# EAGLE design SMALL_EAGLE7 (EAGLE 7.7.0)
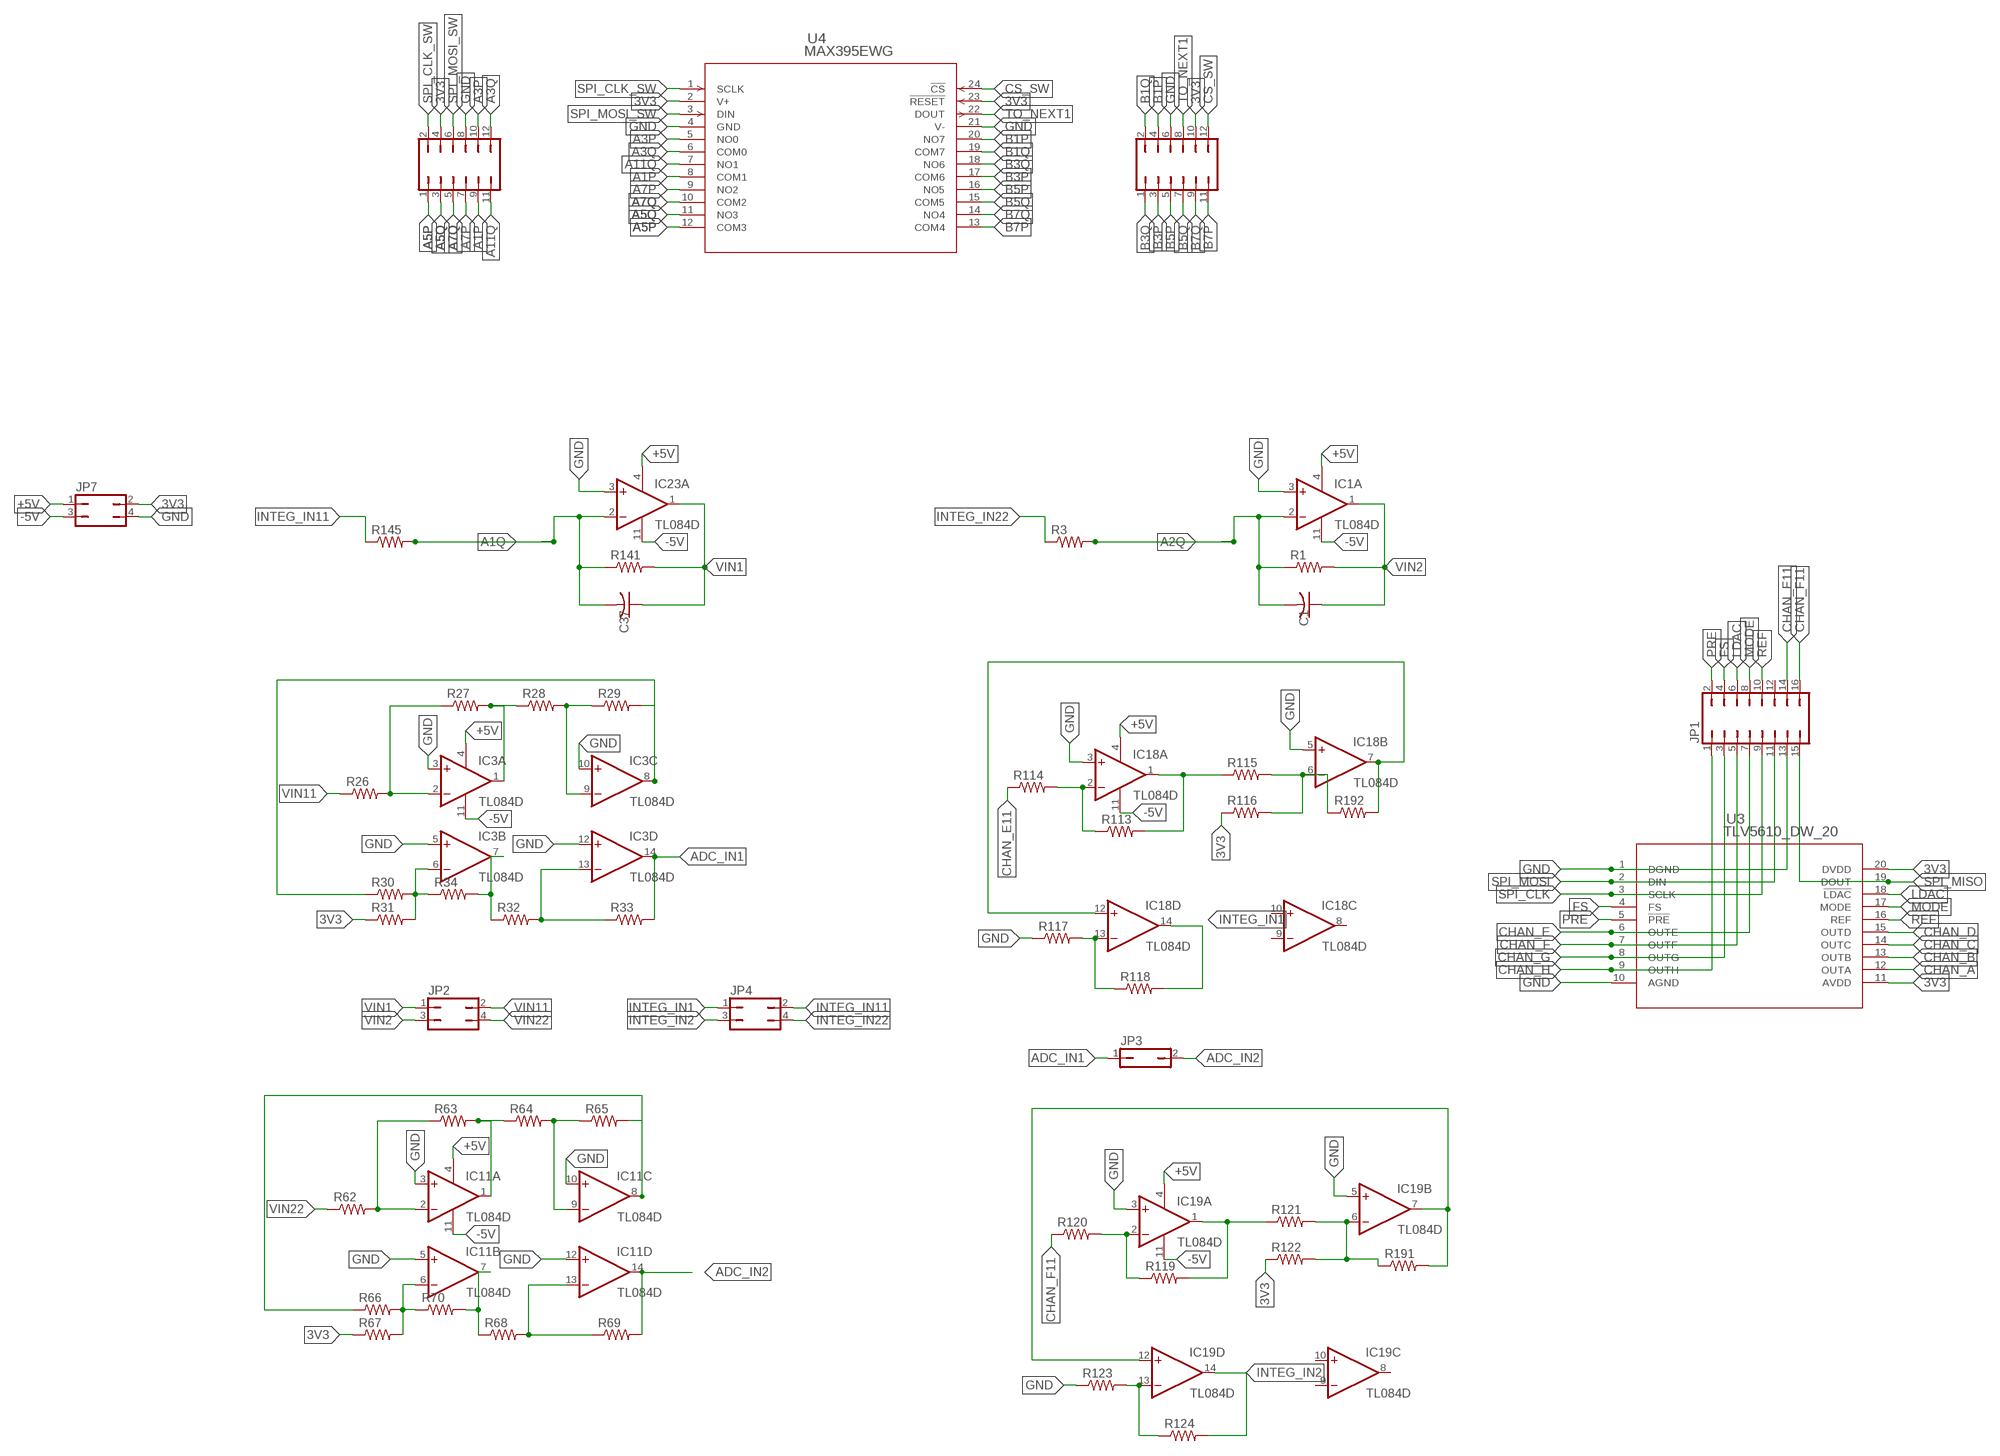
[diagram p0: schematic, sheet 1]

## Parts
C1  C-USC1206  [C1206]
C37  C-USC1206  [C1206]
IC1  TL084D  [SO14]
IC3  TL084D  [SO14]
IC11  TL084D  [SO14]
IC18  TL084D  [SO14]
IC19  TL084D  [SO14]
IC23  TL084D  [SO14]
JP1  JP8Q  [JP8Q]
JP2  JP2Q  [JP2Q]
JP3  JP1Q  [JP1]
JP4  JP2Q  [JP2Q]
JP5  JP6Q  [JP6Q]
JP6  JP6Q  [JP6Q]
JP7  JP2Q  [JP2Q]
R1  R-US_R1206  [R1206]
R3  R-US_R1206  [R1206]
R26  R-US_R1206  [R1206]
R27  R-US_R1206  [R1206]
R28  R-US_R1206  [R1206]
R29  R-US_R1206  [R1206]
R30  R-US_R1206  [R1206]
R31  R-US_R1206  [R1206]
R32  R-US_R1206  [R1206]
R33  R-US_R1206  [R1206]
R34  R-US_R1206  [R1206]
R62  R-US_R1206  [R1206]
R63  R-US_R1206  [R1206]
R64  R-US_R1206  [R1206]
R65  R-US_R1206  [R1206]
R66  R-US_R1206  [R1206]
R67  R-US_R1206  [R1206]
R68  R-US_R1206  [R1206]
R69  R-US_R1206  [R1206]
R70  R-US_R1206  [R1206]
R113  R-US_R1206  [R1206]
R114  R-US_R1206  [R1206]
R115  R-US_R1206  [R1206]
R116  R-US_R1206  [R1206]
R117  R-US_R1206  [R1206]
R118  R-US_R1206  [R1206]
R119  R-US_R1206  [R1206]
R120  R-US_R1206  [R1206]
R121  R-US_R1206  [R1206]
R122  R-US_R1206  [R1206]
R123  R-US_R1206  [R1206]
R124  R-US_R1206  [R1206]
R141  R-US_R1206  [R1206]
R145  R-US_R1206  [R1206]
R191  R-US_R1206  [R1206]
R192  R-US_R1206  [R1206]
U3  TLV5610_DW_20  [DW20]
U4  MAX395EWG  [21-0042B_24]

## Nets
3V3: JP5.4 JP6.10 JP7.2 R31.1 R67.1 R116.1 R122.1 U3.11(AVDD) U3.20(DVDD) U4.2(V+) U4.23(!RESET)
+5V: IC1.4(P:V+) IC3.4(P:V+) IC11.4(P:V+) IC18.4(P:V+) IC19.4(P:V+) IC23.4(P:V+) JP7.1
-5V: IC1.11(P:V-) IC3.11(P:V-) IC11.11(P:V-) IC18.11(P:V-) IC19.11(P:V-) IC23.11(P:V-) JP7.3
A1P: JP5.9 U4.8(COM1)
A1Q: C37.2 IC23.2(A:-IN) R141.1 R145.2
A2Q: C1.2 IC1.2(A:-IN) R1.1 R3.2
A3P: JP5.10 U4.5(NO0)
A3Q: JP5.12 U4.6(COM0)
A5P: JP5.1 U4.12(COM3)
A5Q: JP5.3 U4.11(NO3)
A7P: JP5.7 U4.9(NO2)
A7Q: JP5.5 U4.10(COM2)
A11Q: JP5.11 U4.7(NO1)
ADC_IN1: IC3.14(D:OUT) JP3.1 R33.2
ADC_IN2: IC11.14(D:OUT) JP3.2 R69.2
B1P: JP6.4 U4.20(NO7)
B1Q: JP6.2 U4.19(COM7)
B3P: JP6.3 U4.17(COM6)
B3Q: JP6.1 U4.18(NO6)
B5P: JP6.5 U4.16(NO5)
B5Q: JP6.7 U4.15(COM5)
B7P: JP6.11 U4.13(COM4)
B7Q: JP6.9 U4.14(NO4)
CHAN_A: U3.12(OUTA)
CHAN_B: U3.13(OUTB)
CHAN_C: U3.14(OUTC)
CHAN_D: U3.15(OUTD)
CHAN_E: JP1.7 U3.6(OUTE)
CHAN_E11: JP1.14 R114.1
CHAN_F: JP1.5 U3.7(OUTF)
CHAN_F11: JP1.16 R120.1
CHAN_G: JP1.3 U3.8(OUTG)
CHAN_H: JP1.1 U3.9(OUTH)
CS_SW: JP6.12 U4.24(!CS)
FS: JP1.4 U3.4(FS)
GND [power]: IC1.3(A:+IN) IC3.3(A:+IN) IC3.5(B:+IN) IC3.10(C:+IN) IC3.12(D:+IN) IC11.3(A:+IN) IC11.5(B:+IN) IC11.10(C:+IN) IC11.12(D:+IN) IC18.3(A:+IN) IC18.5(B:+IN) IC19.3(A:+IN) IC19.5(B:+IN) IC23.3(A:+IN) JP1.13 JP5.8 JP6.6 JP7.4 R117.1 R123.1 U3.1(DGND) U3.10(AGND) U4.4(GND) U4.21(V-)
INTEG_IN1: IC18.14(D:OUT) JP4.1 R118.2
INTEG_IN2: IC19.14(D:OUT) JP4.3 R124.2
INTEG_IN11: JP4.2 R145.1
INTEG_IN22: JP4.4 R3.1
LDAC: JP1.6 U3.18(!LDAC)
MODE: JP1.8 U3.17(MODE)
N$36: IC3.2(A:-IN) R26.2 R27.1
N$37: IC3.1(A:OUT) R27.2 R28.1
N$38: IC3.9(C:-IN) R28.2 R29.1
N$39: IC3.8(C:OUT) R29.2 R30.1
N$40: IC3.7(B:OUT) R32.1 R34.2
N$42: IC3.13(D:-IN) R32.2 R33.1
N$43: IC3.6(B:-IN) R30.2 R31.2 R34.1
N$68: IC11.2(A:-IN) R62.2 R63.1
N$69: IC11.1(A:OUT) R63.2 R64.1
N$70: IC11.9(C:-IN) R64.2 R65.1
N$71: IC11.8(C:OUT) R65.2 R66.1
N$72: IC11.7(B:OUT) R68.1 R70.2
N$74: IC11.13(D:-IN) R68.2 R69.1
N$75: IC11.6(B:-IN) R66.2 R67.2 R70.1
N$108: IC18.2(A:-IN) R113.1 R114.2
N$109: IC18.1(A:OUT) R113.2 R115.1
N$110: IC18.6(B:-IN) R115.2 R116.2 R192.1
N$111: IC18.13(D:-IN) R117.2 R118.1
N$113: IC18.7(B:OUT) IC18.12(D:+IN) R192.2
N$114: IC19.2(A:-IN) R119.1 R120.2
N$115: IC19.1(A:OUT) R119.2 R121.1
N$116: IC19.6(B:-IN) R121.2 R122.2 R191.1
N$117: IC19.13(D:-IN) R123.2 R124.1
N$119: IC19.7(B:OUT) IC19.12(D:+IN) R191.2
PRE: JP1.2 U3.5(!PRE)
REF: JP1.10 U3.16(REF)
SPI_CLK: JP1.9 U3.3(SCLK)
SPI_CLK_SW: JP5.2 U4.1(SCLK)
SPI_MISO: JP1.15 U3.19(DOUT)
SPI_MOSI: JP1.11 U3.2(DIN)
SPI_MOSI_SW: JP5.6 U4.3(DIN)
TO_NEXT1: JP6.8 U4.22(DOUT)
VIN1: C37.1 IC23.1(A:OUT) JP2.1 R141.2
VIN2: C1.1 IC1.1(A:OUT) JP2.3 R1.2
VIN11: JP2.2 R26.1
VIN22: JP2.4 R62.1
Unconnected: IC1.5(B:+IN) IC1.6(B:-IN) IC1.7(B:OUT) IC1.8(C:OUT) IC1.9(C:-IN) IC1.10(C:+IN) IC1.12(D:+IN) IC1.13(D:-IN) IC1.14(D:OUT) IC18.8(C:OUT) IC18.9(C:-IN) IC18.10(C:+IN) IC19.8(C:OUT) IC19.9(C:-IN) IC19.10(C:+IN) IC23.5(B:+IN) IC23.6(B:-IN) IC23.7(B:OUT) IC23.8(C:OUT) IC23.9(C:-IN) IC23.10(C:+IN) IC23.12(D:+IN) IC23.13(D:-IN) IC23.14(D:OUT) JP1.12

## Library data of the parts
C1 C37 = rcl:C-US: CAPACITOR, American symbol; SPICEPREFIX: C
IC1 IC3 IC11 IC18 IC19 IC23 = linear:TL084: OP AMP
JP1 = jumper:JP8Q: JUMPER
JP2 JP4 JP7 = jumper:JP2Q: JUMPER
JP3 = jumper:JP1Q: JUMPER
JP5 JP6 = jumper:JP6Q: JUMPER
R1 R3 R26-R34 R62-R70 R113-R124 R141 R145 R191 R192 = rcl:R-US_: RESISTOR, American symbol; SPICEPREFIX: R
U3 = tlv5610a:TLV5610_DW_20; MANUFACTURER_PART_NUMBER: TLV5610_DW_20; VENDOR: Texas Instruments
U4 = max395:MAX395EWG; MANUFACTURER_PART_NUMBER: max395ewg; VENDOR: Maxim Integrated Products

## Net classes
1 power: width 0.254 mm

## Board
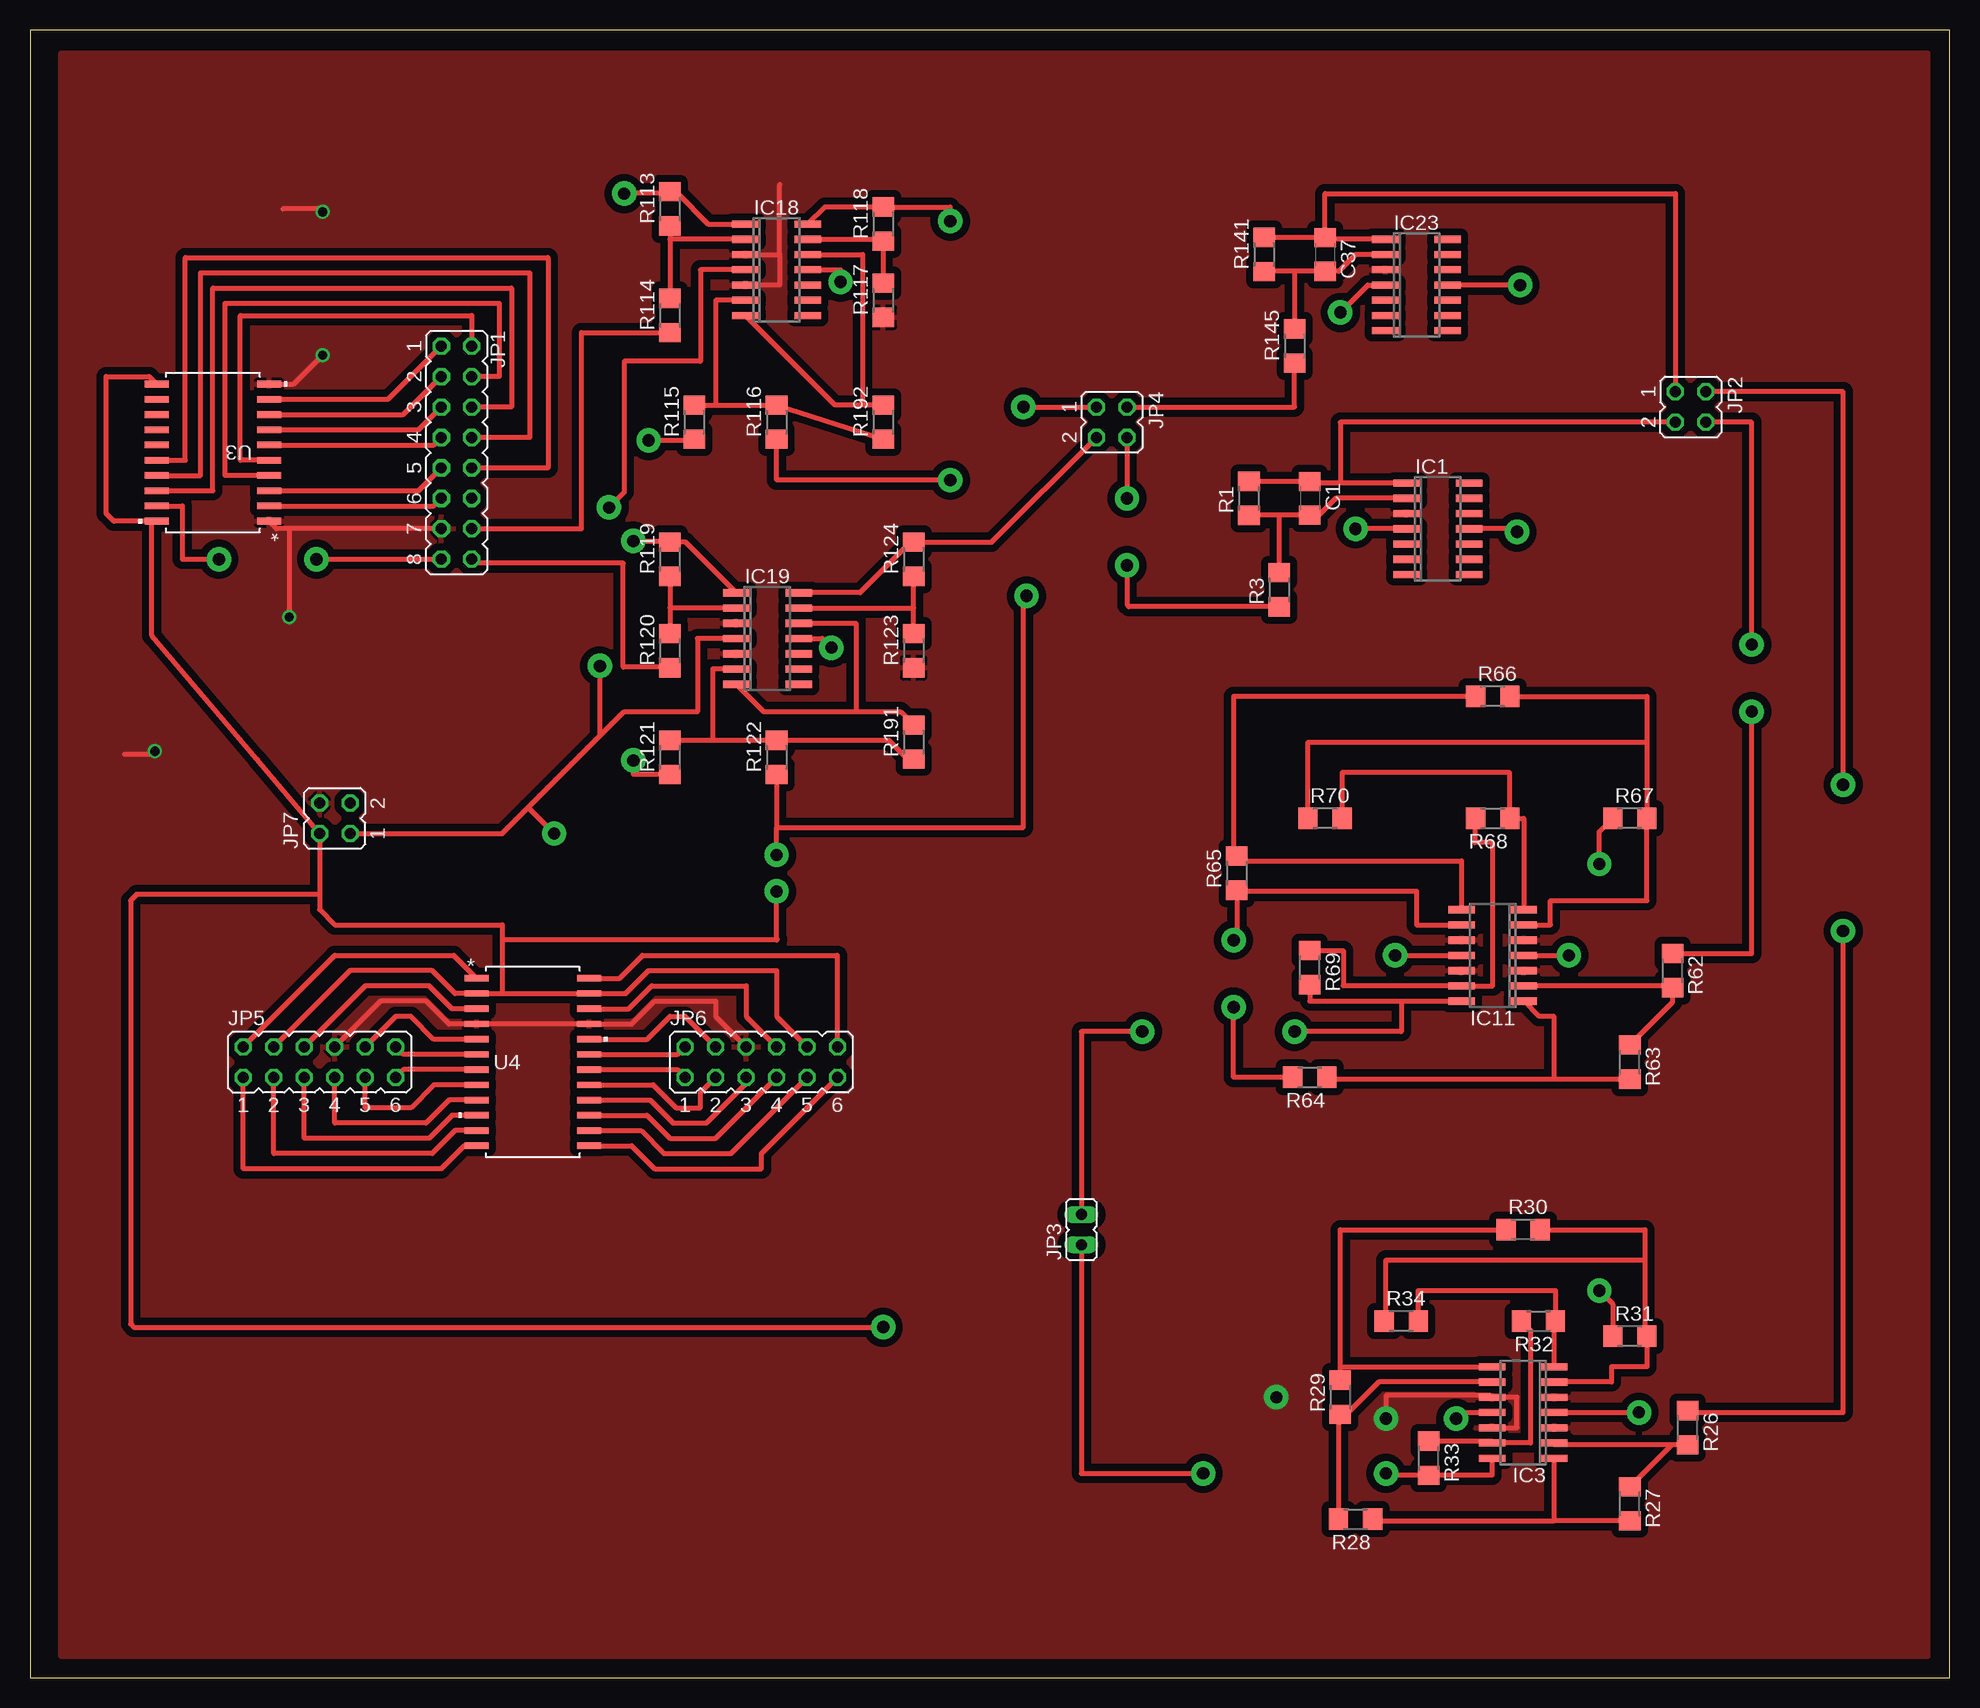
[diagram p1: board, top side]
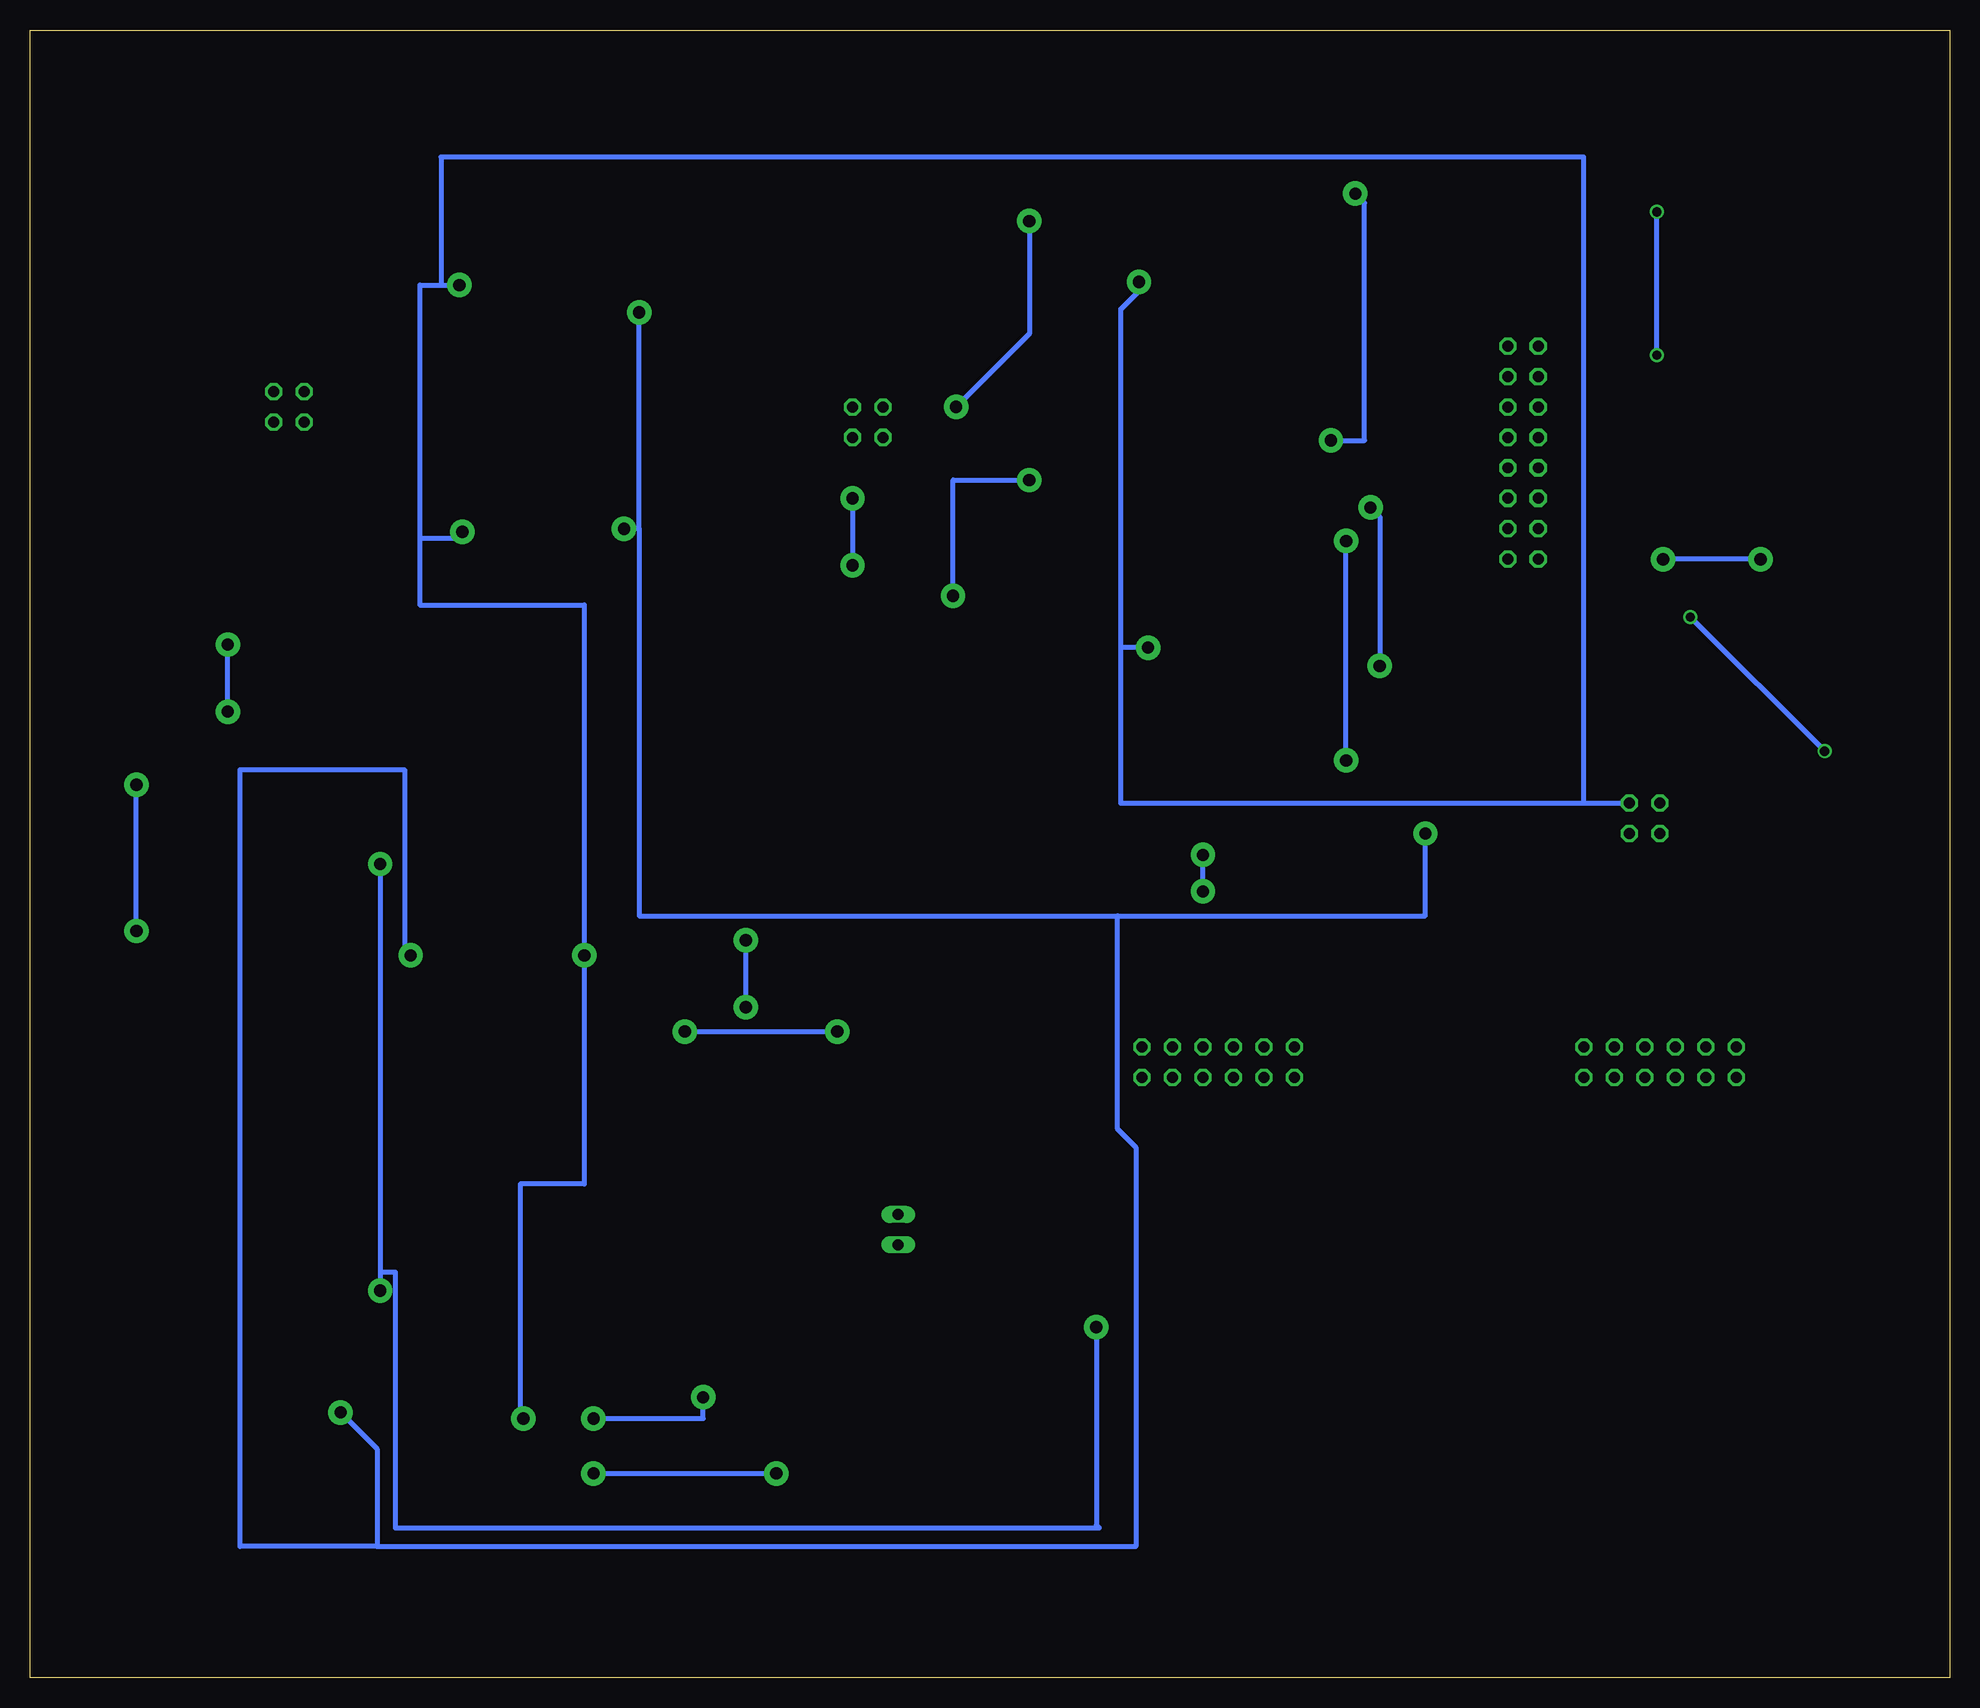
[diagram p2: board, bottom side, seen from below]

Size 160 x 137.34 mm. Coordinates in mm from the lower left corner, seen from the top.
Outline: 0,0 160,0 160,137.34 0,137.34 0,0
Copper layers (1*16): Top 0.035mm / dielectric 1.5mm / Bottom 0.035mm
Design rules "default *": minimum track width 16mil, minimum drill 30mil, track to track 24mil, track to pad 24mil, pad to pad 24mil, via to via 24mil, smd to smd 24mil, copper to edge 24mil, drill to drill 24mil, minimum pad ring 10mil, minimum via ring 8mil, stop-mask expansion 4mil, vias tented up to drill 0mil, thermal gap 10mil

### Footprints (pad centres in the part's own frame; a part is rotated, then mirrored left to right if it is on the bottom)
C1206 = smd 1.6 x 1.8: 1 -1.4,0; 2 1.4,0
SO14 = smd 0.6 x 2.2: 1 -3.81,-2.6; 2 -2.54,-2.6; 3 -1.27,-2.6; 4 0,-2.6; 5 1.27,-2.6; 6 2.54,-2.6; 7 3.81,-2.6; 8 3.81,2.6; 9 2.54,2.6; 10 1.27,2.6; 11 0,2.6; 12 -1.27,2.6; 13 -2.54,2.6; 14 -3.81,2.6
JP8Q = drill 0.914 octagon: 1 -8.89,-1.27; 2 -8.89,1.27; 3 -6.35,-1.27; 4 -6.35,1.27; 5 -3.81,-1.27; 6 -3.81,1.27; 7 -1.27,-1.27; 8 -1.27,1.27; 9 1.27,-1.27; 10 1.27,1.27; 11 3.81,-1.27; 12 3.81,1.27; 13 6.35,-1.27; 14 6.35,1.27; 15 8.89,-1.27; 16 8.89,1.27
JP2Q = drill 0.914 octagon: 1 -1.27,-1.27; 2 -1.27,1.27; 3 1.27,-1.27; 4 1.27,1.27
JP1 = drill 0.914 long: 1 0,-1.27; 2 0,1.27
JP6Q = drill 0.914 octagon: 1 -6.35,-1.27; 2 -6.35,1.27; 3 -3.81,-1.27; 4 -3.81,1.27; 5 -1.27,-1.27; 6 -1.27,1.27; 7 1.27,-1.27; 8 1.27,1.27; 9 3.81,-1.27; 10 3.81,1.27; 11 6.35,-1.27; 12 6.35,1.27
R1206 = smd 1.6 x 1.803: 1 -1.422,0; 2 1.422,0
DW20 = smd 1.981 x 0.559: 1 -4.686,5.715; 2 -4.686,4.445; 3 -4.686,3.175; 4 -4.686,1.905; 5 -4.686,0.635; 6 -4.686,-0.635; 7 -4.686,-1.905; 8 -4.686,-3.175; 9 -4.686,-4.445; 10 -4.686,-5.715; 11 4.686,-5.715; 12 4.686,-4.445; 13 4.686,-3.175; 14 4.686,-1.905; 15 4.686,-0.635; 16 4.686,0.635; 17 4.686,1.905; 18 4.686,3.175; 19 4.686,4.445; 20 4.686,5.715
21-0042B_24 = smd 1.981 x 0.533: 1 -4.686,6.985; 2 -4.686,5.715; 3 -4.686,4.445; 4 -4.686,3.175; 5 -4.686,1.905; 6 -4.686,0.635; 7 -4.686,-0.635; 8 -4.686,-1.905; 9 -4.686,-3.175; 10 -4.686,-4.445; 11 -4.686,-5.715; 12 -4.686,-6.985; 13 4.686,-6.985; 14 4.686,-5.715; 15 4.686,-4.445; 16 4.686,-3.175; 17 4.686,-1.905; 18 4.686,-0.635; 19 4.686,0.635; 20 4.686,1.905; 21 4.686,3.175; 22 4.686,4.445; 23 4.686,5.715; 24 4.686,6.985

### Placement (x,y rotation side)
C1  106.68,98.3 270 top
C37  107.95,118.62 270 top
IC1  117.35,95.76 270 top
IC3  124.46,22.1 90 top
IC11  121.92,60.2 90 top
IC18  62.23,117.35 270 top
IC19  61.47,86.61 270 top
IC23  115.57,116.08 270 top
JP1  35.56,102.11 270 top
JP2  138.43,105.92 270 top
JP3  87.63,37.34 0 top
JP4  90.17,104.65 270 top
JP5  24.13,51.31 0 top
JP6  60.96,51.31 0 top
JP7  25.4,71.63 90 top
R1  101.6,98.3 90 top
R3  104.14,90.68 90 top
R26  138.18,20.83 270 top
R27  133.35,14.48 270 top
R28  110.49,13.21 180 top
R29  109.22,23.37 90 top
R30  124.46,37.34 0 top
R31  133.35,28.45 0 top
R32  125.73,29.72 180 top
R33  116.59,18.29 270 top
R34  114.3,29.72 0 top
R62  136.91,58.93 270 top
R63  133.35,51.31 270 top
R64  106.68,50.04 180 top
R65  100.58,67.06 90 top
R66  121.92,81.79 0 top
R67  133.35,71.63 0 top
R68  121.92,71.63 180 top
R69  106.68,59.18 270 top
R70  107.95,71.63 0 top
R113  53.34,122.43 90 top
R114  53.34,113.54 90 top
R115  55.37,104.65 90 top
R116  62.23,104.65 90 top
R117  71.12,114.81 90 top
R118  71.12,121.16 90 top
R119  53.34,93.22 90 top
R120  53.34,85.6 90 top
R121  53.34,76.71 90 top
R122  62.23,76.71 90 top
R123  73.66,85.6 90 top
R124  73.66,93.22 90 top
R141  102.87,118.62 90 top
R145  105.41,111 90 top
R191  73.66,77.98 90 top
R192  71.12,104.65 90 top
U3  15.24,102.11 180 top
U4  41.91,51.31 0 top

### Tracks (layer width: path | path; a pad name or v marks a point on that pad's centre or on a via)
3V3  (via drill 1.02 pad 2.03)
  Top 0.406: JP5.4 26.67,58.93 33.53,58.93 35.43,57.02 U4.2 39.37,57.02 | JP6.10 62.23,55.12 62.23,58.93 51.56,58.93 49.66,57.02 U4.23 39.37,57.02 | 18.88,76.56 JP7.2 24.13,65.28 | 18.88,76.56 10.16,86.87 10.16,96.39 U3.20 6.99,96.39 6.35,97.03 6.35,108.46 9.92,108.46 U3.11 | 19.05,76.39 18.88,76.56 | 24.13,65.28 24.13,64.01 25.4,62.74 39.37,62.74 39.37,61.47 | 39.37,61.47 39.37,57.02 | R122.1 62.23,70.87 | 62.23,61.47 39.37,61.47 | v130.81,67.82 130.81,70.51 R67.1 | v130.81,32.26 131.93,31.14 R31.1 | 62.23,70.87 82.8,70.87 82.8,90.17 v83.06,90.17 | v76.71,99.82 62.23,99.82 R116.1 | 62.23,61.47 v62.23,65.53 | v62.23,68.58 62.23,70.87 | 62.31,61.54 62.23,61.47 | 24.13,65.28 8.89,65.28 8.38,64.77 8.38,29.46 8.64,29.21 v71.12,29.21
  Bottom 0.406: v130.81,67.82 130.81,33.78 | 130.81,33.78 v130.81,32.26 | v71.12,29.21 71.12,12.7 70.87,12.45 129.54,12.45 129.54,33.78 130.81,33.78 | v83.06,90.17 83.06,99.82 v76.71,99.82 | v62.23,65.53 v62.23,68.58
+5V  (via drill 1.02 pad 2.03)
  Top 0.406: IC19.4 55.63,86.61 55.63,80.52 49.53,80.52 47.5,78.49 | JP7.1 39.37,70.36 41.53,72.52 | 41.53,72.52 47.5,78.49 | IC18.4 55.88,117.35 55.88,109.73 49.53,109.73 49.53,98.81 v48.26,97.54 | v47.5,84.33 47.5,78.49 | IC11.4 v128.27,60.2 | v43.69,70.36 41.53,72.52 | IC3.4 v134.11,22.1 | IC1.4 v110.49,95.76 | v109.22,113.79 111.51,116.08 IC23.4
  Bottom 0.406: v48.26,97.54 47.5,96.77 v47.5,84.33 | 69.34,63.5 43.69,63.5 v43.69,70.36 | 69.34,63.5 69.34,45.72 67.82,44.2 67.82,10.92 131.06,10.92 | 109.22,95.76 v109.22,113.79 | 109.22,95.76 v110.49,95.76 | v134.11,22.1 131.06,19.05 131.06,10.92 | 131.06,10.92 142.49,10.92 142.49,75.69 128.78,75.69 128.78,60.71 v128.27,60.2 | 109.22,95.76 109.22,63.5 69.34,63.5
-5V  (via drill 1.02 pad 2.03)
  Top 0.406: IC18.11 67.56,117.35 v67.56,116.33 | IC19.11 66.04,86.61 v66.8,85.85 | v124.21,116.08 IC23.11 | v123.95,95.5 123.95,95.76 IC1.11 | v113.79,60.2 IC11.11 | v118.87,21.59 119.38,22.1 IC3.11
  Bottom 0.406: v67.56,116.33 67.56,115.57 69.09,114.05 69.09,85.85 | 69.09,85.85 69.09,72.9 30.48,72.9 | 30.48,72.9 JP7.3 | v66.8,85.85 69.09,85.85 | 30.48,72.9 30.48,126.75 125.73,126.75 125.73,116.08 | 127.51,95 127.51,116.08 125.73,116.08 | 127.51,95 127.51,89.41 113.79,89.41 v113.79,60.2 113.79,41.15 119.13,41.15 119.13,21.84 v118.87,21.59 | 125.73,116.08 v124.21,116.08 | 127.51,95 124.46,95 v123.95,95.5
A1P
  Top 0.406: U4.8 33.66,49.4 31.75,47.5 27.94,47.5 JP5.9
A1Q
  Top 0.406: 105.41,117.22 C37.2 109.09,117.22 110.49,118.62 IC23.2 | 105.41,117.22 102.89,117.22 R141.1 | 105.41,117.22 R145.2
A2Q
  Top 0.406: 104.14,96.9 C1.2 107.44,96.9 108.85,98.31 IC1.2 | 104.14,96.9 101.62,96.9 R1.1 | R3.2 104.14,96.9
A3P
  Top 0.406: U4.5 33.66,53.21 31.75,55.12 30.48,55.12 JP5.10
A3Q
  Top 0.406: U4.6 31.11,51.94 JP5.12
A5P
  Top 0.406: U4.12 36.2,44.32 34.29,42.42 17.78,42.42 JP5.1
A5Q
  Top 0.406: U4.11 35.43,45.59 33.53,43.69 20.32,43.69 JP5.3
A7P
  Top 0.406: U4.9 34.92,48.13 33.02,46.23 25.4,46.23 JP5.7
A7Q
  Top 0.406: U4.10 35.18,46.86 33.27,44.96 22.86,44.96 JP5.5
A11Q
  Top 0.406: U4.7 31.75,50.67 31.11,50.67 JP5.11
ADC_IN1  (via drill 1.02 pad 2.03)
  Top 0.406: 121.92,18.29 IC3.14 121.86,16.87 R33.2 113.03,16.87 v113.03,17.02 | JP3.1 87.63,17.02 v97.79,17.02
  Bottom 0.406: v113.03,17.02 v97.79,17.02
ADC_IN2  (via drill 1.02 pad 2.03)
  Top 0.406: R69.2 106.68,56.39 114.3,56.39 | 114.3,56.39 IC11.14 | 114.3,56.39 114.3,53.85 v105.41,53.85 | v92.71,53.85 87.63,53.85 JP3.2
  Bottom 0.406: v105.41,53.85 v92.71,53.85
B1P
  Top 0.406: U4.20 51.44,53.21 53.34,55.12 54.61,55.12 JP6.4
B1Q
  Top 0.406: U4.19 53.98,51.94 JP6.2
B3P
  Top 0.406: U4.17 51.94,49.4 53.85,47.5 55.88,47.5 55.88,48.77 JP6.3
B3Q
  Top 0.406: U4.18 53.98,50.67 JP6.1
B5P
  Top 0.406: U4.16 51.69,48.13 53.59,46.23 56.39,46.23 59.69,49.53 JP6.5
B5Q
  Top 0.406: U4.15 51.44,46.86 53.34,44.96 57.15,44.96 JP6.7
B7P
  Top 0.406: U4.13 50.16,44.32 52.07,42.42 60.96,42.42 60.96,43.69 JP6.11
B7Q
  Top 0.406: U4.14 50.93,45.59 52.83,43.69 58.42,43.69 JP6.9
CHAN_E
  Top 0.406: U3.6 33.66,102.74 JP1.7
CHAN_E11
  Top 0.406: R114.1 45.97,112.12 45.97,95.76 JP1.14
CHAN_F
  Top 0.406: U3.7 32.38,104.01 JP1.5
CHAN_F11
  Top 0.406: R120.1 53.3,84.22 49.46,84.22 49.46,92.9 37.15,92.9 JP1.16
CHAN_G
  Top 0.406: U3.8 31.11,105.28 JP1.3
CHAN_H
  Top 0.406: U3.9 29.84,106.55 JP1.1
CS_SW
  Top 0.406: U4.24 49.15,58.29 51.05,60.2 67.31,60.2 JP6.12
FS
  Top 0.406: U3.4 16.26,100.2 16.26,114.55 39.12,114.55 39.12,108.46 JP1.4
GND  (via drill 0.76, 1.02 pad 2.03)
  Top 0.406: JP1.13 21.59,95.76 | 21.59,95.76 20.56,95.76 U3.1 | JP5.8 29.21,56.39 33.02,56.39 34.92,54.48 U4.4 U4.21 50.16,54.48 52.07,56.39 57.15,56.39 57.15,55.12 JP6.6 | IC18.3 62.48,118.62 | 62.48,118.62 62.48,116.08 IC18.5 | 62.48,118.62 62.48,124.46 | v113.03,21.59 113.03,23.51 121.72,23.51 IC3.10 123.95,23.37 123.95,20.83 IC3.12 | U3.10 21.97,107.82 v24.38,110.24 | v24.38,122.17 24.13,122.43 21.08,122.43 | 21.59,95.76 v21.59,88.39 | v10.41,77.22 10.16,76.96 7.87,76.96
  Bottom 0.406: v113.03,21.59 103.89,21.59 v103.89,23.37 | v24.38,110.24 v24.38,122.17 | v21.59,88.39 v10.41,77.22
  pour Top: 2.54,1.78 158.24,1.78 158.24,135.38 2.54,135.38
INTEG_IN1  (via drill 1.02 pad 2.03)
  Top 0.406: IC18.14 66.25,122.58 R118.2 76.71,122.58 v76.71,121.41 | v82.8,105.92 JP4.1
  Bottom 0.406: v76.71,121.41 76.71,112.01 v82.8,105.92
INTEG_IN2
  Top 0.406: IC19.14 69.19,90.42 73.41,94.64 R124.2 80.16,94.64 JP4.3
INTEG_IN11
  Top 0.406: JP4.2 105.41,105.92 R145.1
INTEG_IN22  (via drill 1.02 pad 2.03)
  Top 0.406: R3.1 91.59,89.26 91.44,89.41 v91.44,92.71 | JP4.4 v91.44,98.3
  Bottom 0.406: v91.44,98.3 v91.44,92.71
LDAC
  Top 0.406: U3.18 15.24,98.93 15.24,115.82 40.13,115.82 40.13,105.92 JP1.6
MODE
  Top 0.406: U3.17 14.22,100.2 14.22,117.09 41.66,117.09 41.66,103.38 JP1.8
N$36
  Top 0.406: 127.06,19.5 IC3.2 127.06,19.41 R26.2 136.86,19.41 R27.1
N$37
  Top 0.406: R27.2 127,13.06 | IC3.1 127,18.23 127,13.06 | R28.1 111.91,13.06 127,13.06
N$38
  Top 0.406: IC3.9 112.42,24.64 109.73,21.95 R29.1 109.07,21.79 R28.2
N$39
  Top 0.406: R29.2 109.22,25.91 IC3.8 | R30.1 109.22,37.34 R29.2 | R29.2 109.22,24.64
N$40
  Top 0.406: 127.06,29.63 R32.1 127.15,32.26 115.72,32.26 R34.2 | 127.06,29.72 127.06,29.63 | IC3.7 127.06,29.63
N$42
  Top 0.406: R32.2 125.07,28.96 125.07,19.56 IC3.13 121.86,19.71 R33.1
N$43
  Top 0.406: R31.2 134.62,28.3 134.62,34.8 | 134.62,34.8 134.62,37.34 R30.2 125.73,37.34 | 113.03,29.87 R34.1 113.03,29.72 113.03,34.8 134.62,34.8 | R31.2 134.62,28.45 | R31.2 134.77,25.91 131.83,25.91 131.83,24.64 IC3.6
N$68
  Top 0.406: R63.1 136.91,56.29 R62.2 136.75,57.66 IC11.2
N$69
  Top 0.406: R64.1 108.1,49.89 127,49.89 | 127,49.89 R63.2 | IC11.1 125.79,55.12 127,55.12 127,49.89
N$70  (via drill 1.02 pad 2.03)
  Top 0.406: R64.2 100.33,50.04 v100.33,55.88 | R65.1 100.58,65.79 | R65.1 100.58,61.72 v100.33,61.47 | R65.1 100.69,65.53 115.57,65.53 115.57,62.74 IC11.9
  Bottom 0.406: v100.33,55.88 v100.33,61.47
N$71
  Top 0.406: R66.1 100.33,81.79 100.33,68.07 100.58,68.07 | 100.58,68.07 R65.2 | 100.58,68.07 119.32,68.07 IC11.8
N$72
  Top 0.406: R70.2 109.37,75.44 123.34,75.44 R68.1 124.52,71.63 IC11.7
N$74
  Top 0.406: R68.2 120.5,69.7 120.4,69.6 121.92,69.6 121.92,57.66 IC11.13 109.47,57.66 109.47,60.6 R69.1
N$75
  Top 0.406: R70.1 106.53,77.98 134.77,77.98 | 134.77,77.98 R67.2 134.77,64.77 126.75,64.77 126.75,62.74 IC11.6 | R66.2 134.77,81.79 134.77,77.98
N$108
  Top 0.406: R113.1 53.34,119.89 | 53.34,119.89 R114.2 | IC18.2 53.34,119.89
N$109  (via drill 1.02 pad 2.03)
  Top 0.406: R113.2 53.42,123.77 | IC18.1 56.54,121.16 53.92,123.77 53.42,123.77 | R115.1 55.27,103.12 v51.56,103.12 | v49.53,123.7 49.61,123.77 53.42,123.77
  Bottom 0.406: v51.56,103.12 48.77,103.12 48.77,122.94 v49.53,123.7
N$110
  Top 0.406: R192.1 R116.2 57.15,106.07 | R115.2 57.15,106.07 | IC18.6 57.15,114.81 57.15,106.07
N$111
  Top 0.406: IC18.13 70.97,119.89 R118.1 R117.2
N$113
  Top 0.406: R192.2 69.4,106.07 | 69.4,106.07 67.1,106.07 IC18.7 | IC18.12 69.4,118.62 69.4,106.07
N$114
  Top 0.406: R119.1 53.34,89.15 | 53.34,89.15 R120.2 | IC19.2 53.34,89.15
N$115  (via drill 1.02 pad 2.03)
  Top 0.406: IC19.1 54.65,94.64 R119.2 53.34,94.74 v50.29,94.74 | R121.1 50.29,75.29 v50.29,76.45
  Bottom 0.406: v50.29,76.45 v50.29,94.74
N$116
  Top 0.406: R121.2 56.9,78.13 | 56.9,78.13 R122.2 71.58,78.13 73.15,76.56 R191.1 | IC19.6 56.9,84.07 56.9,78.13
N$117
  Top 0.406: R123.2 73.66,89.15 | 73.66,89.15 R124.1 | IC19.13 73.66,89.15
N$119
  Top 0.406: IC19.7 61.15,80.52 68.83,80.52 | R191.2 72.54,80.52 68.83,80.52 | IC19.12 68.83,87.88 68.83,80.52
PRE
  Top 0.406: U3.5 17.53,101.47 17.53,113.54 36.83,113.54 JP1.2
REF
  Top 0.406: U3.16 12.95,101.47 12.95,118.36 43.18,118.36 43.18,100.84 JP1.10
SPI_CLK
  Top 0.406: U3.3 32.38,98.93 JP1.9
SPI_CLK_SW
  Top 0.406: JP5.2 25.4,60.2 35.32,60.2 U4.1
SPI_MISO  (via drill 1.02 pad 2.03)
  Top 0.406: U3.19 12.7,97.66 12.7,93.22 v15.75,93.22 | v23.88,93.22 JP1.15
  Bottom 0.406: v15.75,93.22 v23.88,93.22
SPI_MOSI
  Top 0.406: U3.2 33.66,97.66 JP1.11
SPI_MOSI_SW
  Top 0.406: U4.3 35.18,55.75 33.27,57.66 27.94,57.66 JP5.6
TO_NEXT1
  Top 0.406: U4.22 49.91,55.75 51.82,57.66 59.69,57.66 59.69,55.12 JP6.8
VIN1
  Top 0.406: IC23.1 108.08,119.89 C37.1 | C37.1 102.89,120.02 R141.2 | C37.1 107.95,123.7 137.16,123.7 JP2.1
VIN2
  Top 0.406: IC1.1 109.22,99.57 | 109.22,99.57 106.81,99.57 C1.1 101.62,99.7 R1.2 | JP2.3 109.22,104.65 109.22,99.57
VIN11  (via drill 1.02 pad 2.03)
  Top 0.406: JP2.2 151.13,107.19 v151.13,74.42 | R26.1 138.18,22.1 151.13,22.1 v151.13,62.23
  Bottom 0.406: v151.13,62.23 v151.13,74.42
VIN22  (via drill 1.02 pad 2.03)
  Top 0.406: R62.1 143.51,60.35 v143.51,80.52 | JP2.4 143.51,104.65 v143.51,86.11
  Bottom 0.406: v143.51,80.52 v143.51,86.11